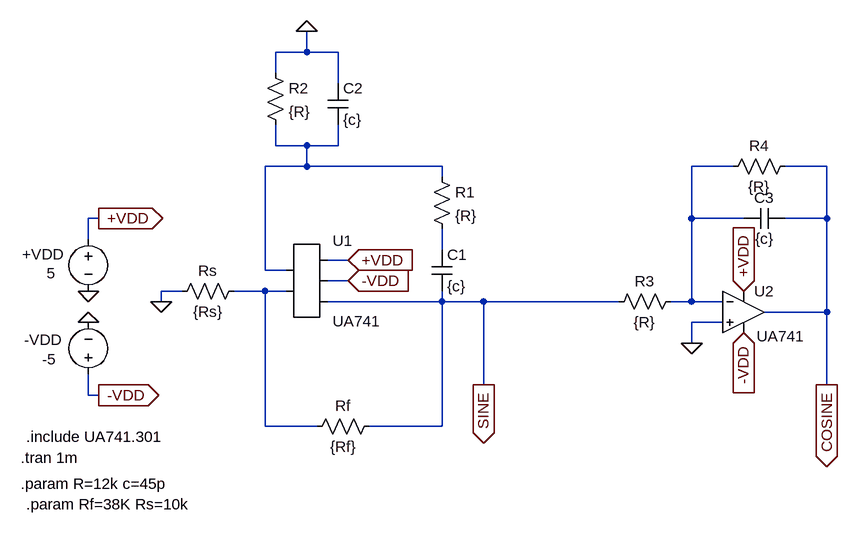
[diagram p0: schematic Oscillator+Integrator.asc]
Oscillator+Integrator.asc, the LTspice schematic file:
Version 4
SHEET 1 1112 680
WIRE 160 -192 160 -224
WIRE 160 -192 112 -192
WIRE 208 -192 160 -192
WIRE 112 -160 112 -192
WIRE 208 -144 208 -192
WIRE 112 -48 112 -80
WIRE 160 -48 112 -48
WIRE 208 -48 208 -80
WIRE 208 -48 160 -48
WIRE 160 -16 160 -48
WIRE 160 -16 96 -16
WIRE 368 -16 160 -16
WIRE 816 -16 752 -16
WIRE 960 -16 896 -16
WIRE 368 0 368 -16
WIRE -160 64 -176 64
WIRE 752 64 752 -16
WIRE 832 64 752 64
WIRE 960 64 960 -16
WIRE 960 64 896 64
WIRE -176 96 -176 64
WIRE 368 112 368 80
WIRE 224 128 192 128
WIRE 96 144 96 -16
WIRE 128 144 96 144
WIRE 224 160 192 160
WIRE -32 176 -64 176
WIRE 96 176 48 176
WIRE 128 176 96 176
WIRE -64 192 -64 176
WIRE 368 192 368 176
WIRE 368 192 192 192
WIRE 432 192 368 192
WIRE 640 192 432 192
WIRE 752 192 752 64
WIRE 752 192 720 192
WIRE 800 192 752 192
WIRE 960 208 960 64
WIRE 960 208 864 208
WIRE 800 224 752 224
WIRE 752 256 752 224
WIRE 432 320 432 192
WIRE 960 320 960 208
WIRE -176 336 -176 304
WIRE -160 336 -176 336
WIRE 96 384 96 176
WIRE 176 384 96 384
WIRE 368 384 368 192
WIRE 368 384 256 384
FLAG -176 176 0
FLAG -176 224 0
FLAG -160 64 +VDD
IOPIN -160 64 Out
FLAG -160 336 -VDD
IOPIN -160 336 Out
FLAG 224 128 +VDD
IOPIN 224 128 In
FLAG 224 160 -VDD
IOPIN 224 160 In
FLAG -64 192 0
FLAG 160 -224 0
FLAG 432 320 SINE
IOPIN 432 320 Out
FLAG 832 176 +VDD
IOPIN 832 176 In
FLAG 832 240 -VDD
IOPIN 832 240 In
FLAG 752 256 0
FLAG 960 320 COSINE
IOPIN 960 320 Out
SYMBOL AutoGenerated\\UA741 160 160 R0
SYMATTR InstName U1
SYMBOL voltage -176 80 R0
WINDOW 0 -102 39 Left 2
WINDOW 3 -64 68 Left 2
WINDOW 123 0 0 Left 0
WINDOW 39 0 0 Left 0
SYMATTR InstName +VDD
SYMATTR Value 5
SYMBOL voltage -176 320 R180
WINDOW 0 40 69 Left 2
WINDOW 3 49 39 Left 2
WINDOW 123 0 0 Left 0
WINDOW 39 0 0 Left 0
SYMATTR InstName -VDD
SYMATTR Value -5
SYMBOL res 272 368 R90
WINDOW 0 0 56 VBottom 2
WINDOW 3 32 56 VTop 2
SYMATTR InstName Rf
SYMATTR Value {Rf}
SYMBOL res 64 160 R90
WINDOW 0 0 56 VBottom 2
WINDOW 3 32 56 VTop 2
SYMATTR InstName Rs
SYMATTR Value {Rs}
SYMBOL res 96 -176 R0
SYMATTR InstName R2
SYMATTR Value {R}
SYMBOL cap 192 -144 R0
SYMATTR InstName C2
SYMATTR Value {c}
SYMBOL res 352 -16 R0
SYMATTR InstName R1
SYMATTR Value {R}
SYMBOL cap 352 112 R0
SYMATTR InstName C1
SYMATTR Value {c}
SYMBOL OpAmps\\opamp2 832 144 R0
WINDOW 3 20 101 Left 2
SYMATTR Value UA741
SYMATTR InstName U2
SYMBOL res 736 176 R90
WINDOW 0 0 56 VBottom 2
WINDOW 3 32 56 VTop 2
SYMATTR InstName R3
SYMATTR Value {R}
SYMBOL cap 896 48 R90
WINDOW 0 0 32 VBottom 2
WINDOW 3 32 32 VTop 2
SYMATTR InstName C3
SYMATTR Value {c}
SYMBOL res 912 -32 R90
WINDOW 0 0 56 VBottom 2
WINDOW 3 32 56 VTop 2
SYMATTR InstName R4
SYMATTR Value {R}
TEXT -280 432 Left 2 !.tran 1m
TEXT -280 472 Left 2 !.param R=12k c=45p
TEXT -272 504 Left 2 !.param Rf=38K Rs=10k
TEXT -272 400 Left 2 !.include UA741.301

The netlist it stands for:
* Oscillator+Integrator.asc
* U1: UA741 (symbol AutoGenerated\UA741 not available, pins judged from their places): pin1=N001 pin2=N004 pin3=+VDD pin4=-VDD pin5=SINE
V§+VDD +VDD 0 5
V§-VDD -VDD 0 -5
Rf SINE N004 {Rf}
Rs N004 0 {Rs}
R2 0 N001 {R}
C2 0 N001 {c}
R1 N001 N003 {R}
C1 N003 SINE {c}
XU2 0 N002 +VDD -VDD COSINE UA741  ; pins In+ In- V+ V- OUT
R3 N002 SINE {R}
C3 COSINE N002 {c}
R4 COSINE N002 {R}
.tran 1m
.param R=12k c=45p
.param Rf=38K Rs=10k
.include UA741.301
.backanno
.end